# Altium schematic sheet Sheet2.SchDoc
size A4
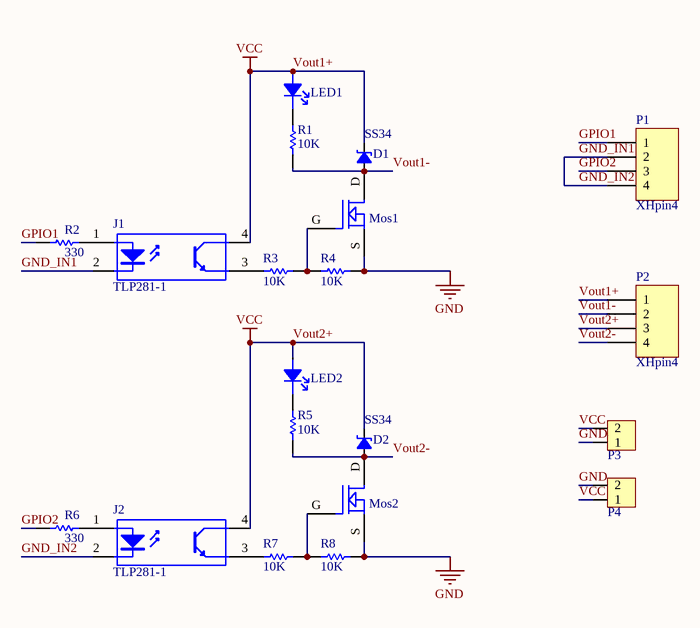
[diagram p0: Sheet2.SchDoc]

## Parts
D1  SS34  [DO-214AC]
D2  SS34  [DO-214AC]
J1  TLP281-1  [TLP281-1]
J2  TLP281-1  [TLP281-1]
LED1  lED  [0805D]  (value not drawn)
LED2  lED  [0805D]  (value not drawn)
Mos1  MOSFET N  [Nmos_SOT23]  (value not drawn)
Mos2  MOSFET N  [Nmos_SOT23]  (value not drawn)
P1  XHpin4  [XH-2.54pin4]
P2  XHpin4  [XH-2.54pin4]
P3  Connector  [XT30_PW_M]  (value not drawn)
P4  Connector  [XT30_PW_F]  (value not drawn)
R1  value 10K  [RES-0603]  (hidden comment: Res1)
R2  value 330  [RES-0603]  (hidden comment: Res1)
R3  value 10K  [RES-0603]  (hidden comment: Res1)
R4  value 10K  [RES-0603]  (hidden comment: Res1)
R5  value 10K  [RES-0603]  (hidden comment: Res1)
R6  value 330  [RES-0603]  (hidden comment: Res1)
R7  value 10K  [RES-0603]  (hidden comment: Res1)
R8  value 10K  [RES-0603]  (hidden comment: Res1)

## Nets
GND: Mos1.S Mos2.S P3.1 P4.2 R4.2 R8.2
VCC: D1.2(K) D2.2(K) J1.4(C) J2.4(C) LED1.A LED2.A P2.1 P2.3 P3.2 P4.1  [also labelled Vout1+, Vout2+]
GND_IN1: J1.2(K) J2.2(K) P1.2 P1.4  [also labelled GND_IN2]
GPIO1: P1.1 R2.1
GPIO2: P1.3 R6.1
Vout1-: D1.1(A) Mos1.D P2.2 R1.1
Vout2-: D2.1(A) Mos2.D P2.4 R5.1
NetJ1_1: J1.1(A) R2.2
NetJ1_3: J1.3(E) R3.1
NetJ2_1: J2.1(A) R6.2
NetJ2_3: J2.3(E) R7.1
NetLED1_K: LED1.K R1.2
NetLED2_K: LED2.K R5.2
NetMos1_G: Mos1.G R3.2 R4.1
NetMos2_G: Mos2.G R7.2 R8.1

## Library data of the parts
D1 D2 = SS34: Diode
  D1: Value: SS34
J1 J2 = TLP281-1: 光耦
LED1 LED2 = 00-D-LED
Mos1 Mos2 = MOSFET N: MOS SOT23
P1 P2 = XH4: XH-2.54PIN4
P3 P4 = 2P
R1-R8 = Res1: Resistor; Published: 8-Jun-2000; LatestRevisionDate: 17-Jul-2002; LatestRevisionNote: Re-released for DXP Platform.; PackageReference: AXIAL-0.3; Publisher: Altium Limited